# Altium schematic sheet MainBoard_V100_PER.SchDoc
size A4; SheetNumber: 16; SheetTotal: 22; Title_: Pheripherial Connector
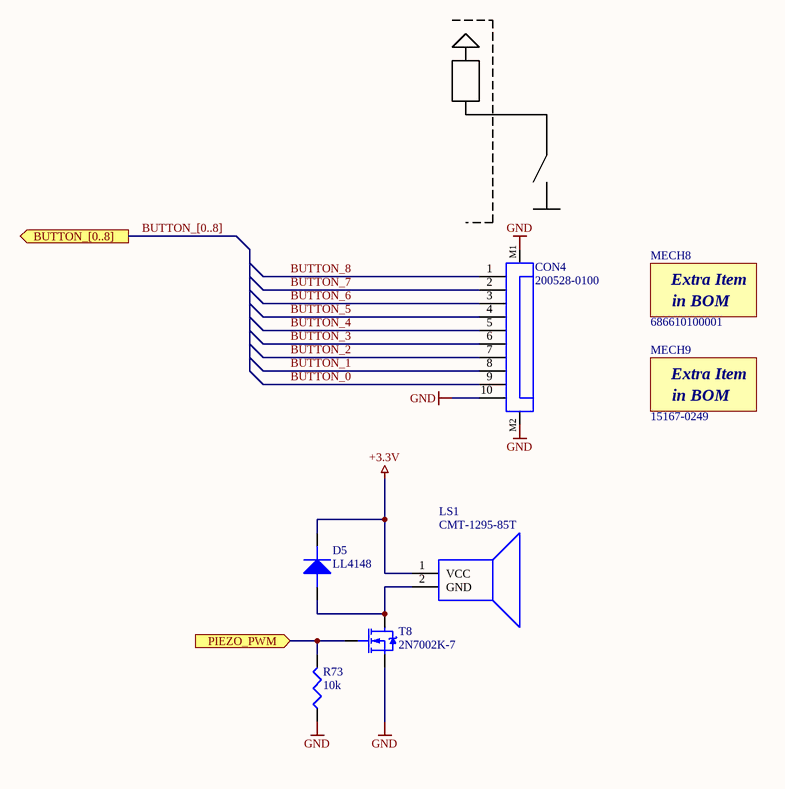
[diagram p0: MainBoard_V100_PER.SchDoc]

## Parts
CON4  200528-0100  [CON_FPC10_1MM_MOLEX_200528-0100]
D5  LL4148  [SOD80]
LS1  CMT-1295-85T  [BUZZER_KXG1205]
MECH8  686610100001  (mechanical)
MECH9  15167-0249  (mechanical)
R73  10k  [0805]
T8  2N7002K-7  [SOT-23]

## Ports
BUTTON_[0..8] (out), PIEZO_PWM (in)

## Nets
+3.3V: D5.K LS1.1(VCC)
GND: CON4.10 CON4.M1 CON4.M2 R73.1 T8.2(S)
BUTTON_0: CON4.9
BUTTON_1: CON4.8
BUTTON_2: CON4.7
BUTTON_3: CON4.6
BUTTON_4: CON4.5
BUTTON_5: CON4.4
BUTTON_6: CON4.3
BUTTON_7: CON4.2
BUTTON_8: CON4.1
PIEZO_PWM: R73.2 T8.1(G) ; port PIEZO_PWM
NetD5_A: D5.A LS1.2(GND) T8.3(D)

## Buses and harness runs
bus BUTTON_[0..8] = port BUTTON_[0..8]

## Notes on the sheet
- Board:
- Author:
- Title:
- Project:
- SVN:
- Version:
- Sheet:
- of
- Contact:
- Modified:
- Size:
- A4
- (in symbol 411) Extra Item; in BOM
- (in symbol 412) Extra Item; in BOM

## Library data of the parts
CON4 = 228: FFC / FPC Board Connector, 1 mm, 10 Contacts, Receptacle, Easy-On, Surface Mount; Part Number: CON_FPC_MOLEX_200528-0100; Azonosító: 228; Category: Connectors; Subcategory: CONN_Board-to-Wire; Supplier 1: MOUSER; Supplier 1 order number: 538-200528-0100; System: Connector
D5 = 372: General Purpose, Power, Switching Small Signal Diode, SOD-80, 100V, 0.15A, 175C; Azonosító: 372; Part Number: LL4148; Category: Semiconductors; Subcategory: SEMI_Diode; Supplier 1: MOUSER; Supplier 1 order number: 637-LL4148; Supplier 2: HESTORE; Supplier 2 order number: 100.230.69; Help URL: https://diotec.com/request/datasheet/ll4148.pdf
LS1 = 407: Piezo Buzzers & Audio Indicators, 2.4kHz, 12mm, Magnetic, 3V THT; Azonosító: 407; Part Number: CMT-1295-85T; Category: Electro-mechanicals; Subcategory: ELME_Other; Supplier 1: MOUSER; Supplier 1 order number: 179-CMT-1295-85T; Help URL: https://hu.mouser.com/datasheet/2/670/cmt_1295_85t-3388234.pdf
MECH8 = 411: FFC / FPC Jumper Cables WR-FFC 1mm Type 1 10P 100mm length; Azonosító: 411; Part Number: 686610100001; Category: Accessories; Subcategory: ACCE_Other; Supplier 1: MOUSER; Supplier 1 order number: 710-686610100001; Help URL: https://www.we-online.com/components/products/datasheet/686610100001.pdf
MECH9 = 412: FFC / FPC Jumper Cables FFC 1.00mm Type A 10 contact 76mm; Azonosító: 412; Part Number: 15167-0249; Category: Accessories; Subcategory: ACCE_Other; Supplier 1: MOUSER; Supplier 1 order number: 538-15167-0249; Help URL: https://www.molex.com/en-us/products/part-detail/151670249?display=pdf
R73 = 59: 10k 0805 0.125W 1%; Part Number: SMD0805-10k 1%; Azonosító: 59; Category: Passives; Subcategory: PASS_Resistor; Supplier 1: HESTORE; Supplier 1 order number: 100.403.38
T8 = 315: 2N7002K-7 Power MOSFET, N Channel, 60 V, 300 mA, 2 ohm, SOT-23, Surface Mount; Azonosító: 315; Part Number: 2N7002K-7; Category: Semiconductors; Subcategory: SEMI_FET; Supplier 1: HESTORE; Supplier 1 order number: 100.411.92; Supplier 2: MOUSER; Supplier 2 order number: 621-2N7002K-7; Help URL: https://hu.mouser.com/datasheet/2/115/DIOD_S_A0012992590_1-2543827.pdf